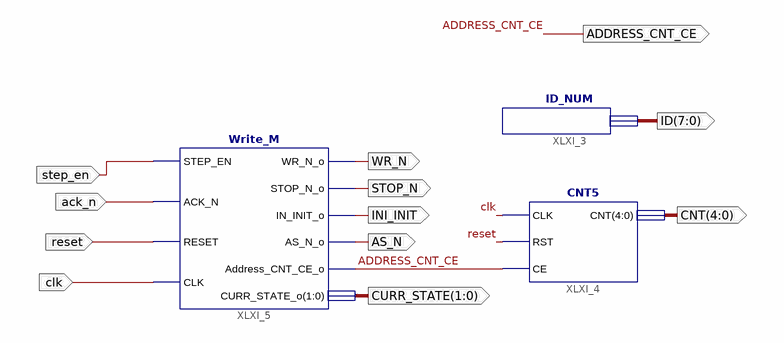
[diagram p0: schematic sheet 1]
// Xilinx ISE schematic write_machinem.sch (spartan6) as structural Verilog: 3 symbols, 12 ports
module write_machinem (
  input  reset,
  input  clk,
  input  step_en,
  input  ack_n,
  output AS_N,
  output INI_INIT,
  output WR_N,
  output STOP_N,
  output [1:0] CURR_STATE,
  output ADDRESS_CNT_CE,
  output [4:0] CNT,
  output [7:0] ID
);

  CNT5 XLXI_4 (.CLK(clk), .RST(reset), .CE(ADDRESS_CNT_CE), .CNT(CNT));
  ID_NUM XLXI_3 (.ID(ID));
  Write_M XLXI_5 (
    .STEP_EN(step_en), .ACK_N(ack_n), .RESET(reset), .CLK(clk), .WR_N_o(WR_N), .STOP_N_o(STOP_N),
    .IN_INIT_o(INI_INIT), .AS_N_o(AS_N), .Address_CNT_CE_o(ADDRESS_CNT_CE), .CURR_STATE_o(CURR_STATE));
endmodule
